# Altium schematic sheet 05-StepperMotor.SchDoc
size A
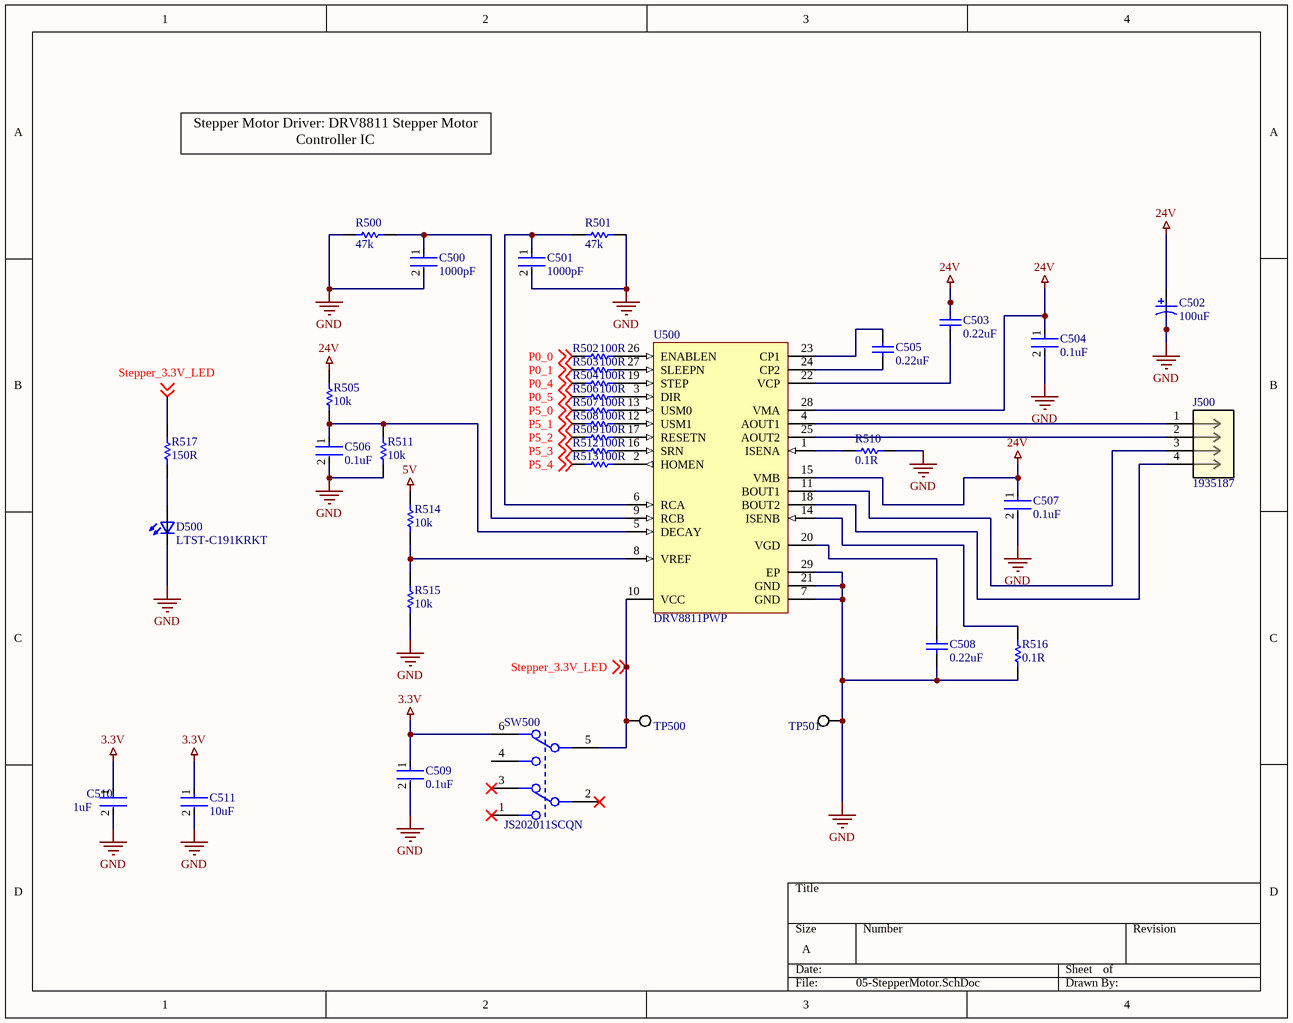
[diagram p0: 05-StepperMotor.SchDoc]

## Parts
C500  1000pF  [FP-0805-L_2_01_0_2-W_1_25-IPC_C]
C501  1000pF  [FP-0805-L_2_01_0_2-W_1_25-IPC_C]
C502  100uF  [PNSC-EEEFK1C101P_L]
C503  0.22uF  [CAPC2013X94X50ML20T25]
C504  0.1uF  [FP-CL21-IPC_C]
C505  0.22uF  [CAPC2013X94X50ML20T25]
C506  0.1uF  [FP-CL21-IPC_C]
C507  0.1uF  [FP-CL21-IPC_C]
C508  0.22uF  [CAPC2013X94X50ML20T25]
C509  0.1uF  [FP-CL21-IPC_C]
C510  1uF  [FP-CC0805-0_85-MFG]
C511  value 10uF  [FP-C0805C-DG-MFG]  (hidden comment: C0805C106K8PACTU)
D500  LTST-C191KRKT  [0603]
J500  1935187  [1935187]
R500  47k  [RESC2013X70X40ML20T20]
R501  47k  [RESC2013X70X40ML20T20]
R502  100R  [RESC2013X60X40ML20T25]
R503  100R  [RESC2013X60X40ML20T25]
R504  100R  [RESC2013X60X40ML20T25]
R505  10k  [RESC2013X60X35ML10T20]
R506  100R  [RESC2013X60X40ML20T25]
R507  100R  [RESC2013X60X40ML20T25]
R508  100R  [RESC2013X60X40ML20T25]
R509  100R  [RESC2013X60X40ML20T25]
R510  0.1R  [RESC2013X50X40ML20T20]
R511  10k  [RESC2013X60X35ML10T20]
R512  100R  [RESC2013X60X40ML20T25]
R513  100R  [RESC2013X60X40ML20T25]
R514  10k  [RESC2013X60X35ML10T20]
R515  10k  [RESC2013X60X35ML10T20]
R516  0.1R  [RESC2013X50X40ML20T20]
R517  150R  [RESC3216X70X50ML20T25]
SW500  JS202011SCQN  [FP-JS202011SCQN-MFG]
TP500  5019  [KSTN-5019_V]  (value not drawn)
TP501  5019  [KSTN-5019_V]  (value not drawn)
U500  DRV8811PWP  [StepperMotor]

## Nets
3.3V: C509.1 C510.1 C511.1 SW500.6
5V: R514.2
24V: C502.1 C503.2 C504.1 C507.1 R505.2 U500.15(VMB) U500.28(VMA)
GND: C500.2 C501.2 C502.2 C504.2 C506.2 C507.2 C508.1 C509.2 C510.2 C511.2 D500.1(K2) R500.1 R501.2 R510.2 R511.1 R515.1 R516.1 TP501.1 U500.7(GND) U500.21(GND) U500.29(EP)
P0_0: R502.1 ; off-sheet P0_0
P0_1: R503.1 ; off-sheet P0_1
P0_4: R504.1 ; off-sheet P0_4
P0_5: R506.1 ; off-sheet P0_5
P5_0: R507.1 ; off-sheet P5_0
P5_1: R508.1 ; off-sheet P5_1
P5_2: R509.1 ; off-sheet P5_2
P5_3: R512.1 ; off-sheet P5_3
P5_4: R513.1 ; off-sheet P5_4
Stepper_3.3V_LED: R517.2 SW500.5 TP500.1 U500.10(VCC) ; off-sheet Stepper_3.3V_LED
NetC500_1: C500.1 R500.2 U500.9(RCB)
NetC501_1: C501.1 R501.1 U500.6(RCA)
NetC503_1: C503.1 U500.22(VCP)
NetC505_1: C505.1 U500.24(CP2)
NetC505_2: C505.2 U500.23(CP1)
NetC506_1: C506.1 R505.1 R511.2 U500.5(DECAY)
NetC508_2: C508.2 U500.20(VGD)
NetD500_2: D500.2(A2) R517.1
NetJ500_1: J500.1 U500.4(AOUT1)
NetJ500_2: J500.2 U500.25(AOUT2)
NetJ500_3: J500.3 U500.11(BOUT1)
NetJ500_4: J500.4 U500.18(BOUT2)
NetR502_2: R502.2 U500.26(ENABLEN)
NetR503_2: R503.2 U500.27(SLEEPN)
NetR504_2: R504.2 U500.19(STEP)
NetR506_2: R506.2 U500.3(DIR)
NetR507_2: R507.2 U500.13(USM0)
NetR508_2: R508.2 U500.12(USM1)
NetR509_2: R509.2 U500.17(RESETN)
NetR510_1: R510.1 U500.1(ISENA)
NetR512_2: R512.2 U500.16(SRN)
NetR513_2: R513.2 U500.2(HOMEN)
NetR514_1: R514.1 R515.2 U500.8(VREF)
NetR516_2: R516.2 U500.14(ISENB)

Not connected (* = marked no-connect by the designer): SW500 1* 2* 3* 4

## Notes on the sheet
- Stepper Motor Driver: DRV8811 Stepper Motor Controller IC

## Library data of the parts
C500 C501 = CMP-2007-04270-2: General Purpose Ceramic Capacitor, 0805, 1nF, 5%, C0G, 30ppm/°C, 50V; Insulation Resistance: 100GR; Capacitance: 1nF; Voltage Rating (DC): 50V; Packaging: Tape and Reel; Min Operating Temperature: -55°C; Series: -; Construction: Flat; Tolerance: 5%; RoHS Compliant: Yes; Package Quantity: 1; Case Code (Metric): 2012; Lead Free: Lead Free; Thickness: 0.037inch; REACH SVHC: No SVHC; Temperature Coefficient: 30ppm/°C; Case/Package: 0805; Case Code: 0805; Radiation Hardening: No; Size: 0.94mm; Height: 0.94mm; Width: 0.049inch; Number of Pins: 2; Depth: 1.25mm; Dielectric: C0G; Contact Plating: Tin; Length: 2.01mm; Voltage: 50V; Voltage Rating: 50V; Max Operating Temperature: 125°C; Mount: Surface Mount; Case Code (Imperial): 0805; Termination: SMD/SMT
C502 = CMP-2000-06203-1: Aluminum Electrolytic Capacitor, 100 uF, 20%, 16 V, -55 to 105 degC, 2-Pin SMD, RoHS, Tape and Reel; Manufacturer: Panasonic; Lifetime@Temperature: 2000Hrs@105°C; Impedance: 0.36O; Ripple Current: 240mA; Rated Voltage: 16V; Type: Can; Capacitance: 100µF; Datasheet URL: http://datasheet.octopart.com/EEEFK1C101P-Panasonic-datasheet-13266987.pdf; Package Description: 2-Pin Surface Mount Device, Body 6.6 x 6.6 mm; Manufacturer URL: http://www.panasonic.com/; Case Size/Dimension: Ø6.3x5.8mm; Series: FK; Datasheet Version: 11/2012; Mounting Technology: SurfaceMount; Package Reference: EEEFK1C101P; Operating Temp-Max: 105°C; Operating Temp Range: -55to+105°C
C503 C505 C508 = CMP-2007-04189-1: Part Number: 08051C224KAT2A; Manufacturer: AVX Interconnect / Elco
C504 C506 C507 C509 = CMP-2000-05017-2: CL21 Series 0805 100nF 50V ±10% Tolerance X7R Multilayer Ceramic Chip Capacitor; Depth: 1.25mm; Height: 0.85mm; Width: 0.049inch; Tolerance: 10%; Case Code (Metric): 2012; Case Code (Imperial): 0805; Material: Ceramic; Thickness: 0.037inch; Min Operating Temperature: -55°C; Contact Plating: Tin; Length: 2mm; Mount: Surface Mount; Voltage Rating (DC): 50V; Lead Free: Lead Free; Dielectric: X7R; Radiation Hardening: No; Capacitance: 100nF; Voltage Rating: 50V; Case/Package: 0805; Packaging: Tape and Reel; Max Operating Temperature: 125°C; Voltage: 50V
C510 = CMP-03422-000182-1: CAP CER 1UF 10V X7R 0805; Manufacturer: Yageo; Manufacturer Part Number: CC0805KKX7R6BB105; Material: Ceramic; Tolerance: 0.1; Value: 1 uF; ComponentLink2URL: http://www.yageo.com/documents/recent/UPY-GPHC_Y5V_6.3V-to-50V_8.pdf; Automotive: No; Temperature Range Low: -30°C; Octopart: https://octopart.com/cc0805kkx7r6bb105-yageo-42522859; Temperature Characteristic: X7R; RoHS: TRUE; Voltage Rating: 10 V; Capacitance: 1 uF; Package: CC0805-0.85; Device Class L3: Ceramic Capacitors; Category: Cap; Mouser Description: Multilayer Ceramic Capacitors MLCC - SMD/SMT 1.0uF 10V X7R 10%; Temperature Range High: +85°C; Ipc Land Pattern Name: CAPC200125X85; ComponentLink2Description: Datasheet; Temperature: -30°C to +85°C; Height: 0.95mm; Lead Free: Yes; Device Class L1: Passive Components; Device Class L2: Capacitors; Footprint Url: http://www.yageo.com/exep/pages/download/literatures/UPY-C_GEN_24.pdf; Digikey Description: CAP CER 1UF 10V X7R 0805
C511 = CMP-2007-03243-2: CAP CER 10UF 10V X5R 0805; Manufacturer: Kemet; 3DS Part Number: 220-00001; Tolerance: 10%; Temperature Coefficient: 15%; Material: Ceramic; Device Class L2: Capacitors; Device Class L1: Passive Components; ComponentLink2URL: https://content.kemet.com/datasheets/KEM_C1006_X5R_SMD.pdf; Height: 1.4mm; Lead Free: Yes; Manufacturer Part Number: C0805C106K8PACTU; Digikey Description: CAP CER 10UF 10V X5R 0805; Octopart: https://octopart.com/c0805c106k8pactu-kemet-98697; Capacitance: 10uF; Temperature Range Low: -55°C; Temperature: -55°C to +85°C; Automotive: No; Mouser Description: CAP CER 10UF 10V X5R 0805; Ipc Land Pattern Name: CAPC200125X125; Temperature Range High: +85°C; Voltage: 10V; RoHS: TRUE; Device Class L3: Ceramic Capacitors; ComponentLink2Description: Datasheet; Voltage Rating: 10V; Package: C0805C-DG; Temperature Characteristic: X5R; Category: Cap; Supplier 1: Digi-Key; Supplier Part Number 1: 399-C0805C106K8PAC7800CT-ND; Manufacturer 1: KEMET; Manufacturer Part Number 1: C0805C106K8PACTU; Stock 1: 8631846; Pricing 1: 1=0.14000, 10=0.10300, 50=0.05840, 100=0.04830, 500=0.03388, 1000=0.02805 (USD); Mount: Surface Mount; Case/Package: 0805; Number of Pins: 2; Case Code (Imperial): 0805; Case Code (Metric): 2012; Dielectric Material: Ceramic; Contact Plating: Tin,Matte; Min Operating Temperature: -55°C; Max Operating Temperature: 85°C; Packaging: Tape and Reel; Dielectric: X5R; Package Quantity: 1; Voltage Rating (DC): 10V; Series: C; Termination: SMD/SMT; Construction: Flat; Dissipation Factor: 10%; Length: 2mm; Width: 1.2mm; Depth: 1.25mm; Thickness: 0.055inch; Radiation Hardening: No; REACH SVHC: No SVHC; RoHS Compliant: Yes
D500 = LTST-C191KRKT: http://octopart.com/ltst-c190krkt-lite-on-549893; Package: None; MP: LTST-C191KRKT; Value: *; Availability: Unavailable; Price: None; Supplier 1: Digi-Key; Supplier Part Number 1: 160-1447-1-ND
J500 = 1935187: No Description Available; Mfr_Name: Phoenix Contact; RefDes: RefDes; Type: Type; Supplier 1: Digi-Key; Supplier Part Number 1: 277-1579-ND
R500 R501 = CMP-2001-00421-1: Manufacturer: Panasonic; Part Number: ERJ-6GEYJ473V
R502-R504 R506-R509 R512 R513 = CMP-2001-00580-1: Manufacturer: Panasonic; Part Number: ERA6AEB101V
R505 R511 R514 R515 = CMP-2000-05025-1: Chip Resistor, 10 KOhm, +/- 5%, 0.125 W, -55 to 155 degC, 0805 (2012 Metric), RoHS, Tape and Reel; Manufacturer: Yageo; Resistor Element Type: ThickFilm; Voltage Rating: 150V; Product Range: RCSeries; SVHC: ToBeAdvised; Resistor Case Style: 0805[2012Metric]; Temperature Coefficient: ±100ppm/degC; Power Rating: 250mW; Resistance: 10kohm; Automotive Qualification Standard: -; Datasheet Version: REV. 2, 09/2004; Packaging: CutTape; Resistance Tolerance: ±5%; MSL: MSL1-Unlimited; Manufacturer URL: http://www.yageo.com/; Datasheet URL: http://www.yageo.ru/pdf/RC0805.pdf; Package Description: 2-Pin Surface Mounted Device, Body 2 x 1.25 mm; Package Reference: 805
R510 R516 = CMP-2001-03150-1: Manufacturer: Susumu; Part Number: RL1220S-R10-F
R517 = CMP-2003-04422-1: Manufacturer: Panasonic; Part Number: ERA8AEB151V
SW500 = CMP-2000-05087-3: SWITCH SLIDE DPDT 300MA 6V; Switch Function: On-On; Actuator Type: Standard; Switch Travel: 2mm; Actuator Color: Black; Contact Resistance: 70mR; Electrical Life: 5000Cycles; Actuator Material: Nylon; REACH SVHC: No SVHC; Series: JS; Min Operating Temperature: -20°C; Depth: 7.5mm; Housing Material: Nylon; Voltage Rating (DC): 6V; Max Operating Temperature: 85°C; Contact Current Rating: 300mA; Package Quantity: 1; Contact Plating: Silver; Contact Material: Copper Alloy; Throw Configuration: DPDT; Current Rating: 300mA; Orientation: Vertical; Max Current Rating: 300mA; Max Voltage Rating (DC): 6V; Flammability Rating: UL94 V-2; Length: 9mm; Packaging: Tape and Reel; Mount: Surface Mount; Actuator Length: 2mm; Lead Free: Lead Free; Termination: Gull Wing; Radiation Hardening: No
TP500 TP501 = CMP-1672-00008-1: Test Point, 1 Position SMD, RoHS, Tape and Reel; Manufacturer 1: Keystone Electronics; ComponentLink1Description: Manufacturer URL; Package Quantity: 1000; DatasheetVersion: 03/2014; Packaging: Tape and Reel; ComponentLink2URL: http://www.keyelco.com/product-pdf.cfm?p=1357; ComponentLink1URL: http://www.keyelco.com/; Mount: Surface Mount; Contact Plating: Silver; PackageDescription: 1-Pin Surface Mount Device, Body 3.81 x 2.03 mm; Pins: 1; RoHSCompliant: True; Mounting Technology: Surface Mount; ComponentLink2Description: Datasheet; PackageReference: 5019; Supplier 1: Digi-Key; Supplier Part Number 1: 36-5019CT-ND; Manufacturer Part Number 1: 5019; RoHS: Yes; Category: Connectors; Stock 1: 1316816; Pricing 1: 1=0.34000, 25=0.27360, 100=0.22340, 250=0.20064, 500=0.19152 (USD); Number of Pins: 1; Material: Bronze; Contact Material: Bronze; Series: 5019; Termination: SMD/SMT; Height: 0.09inch; RoHS Compliant: Yes; REACH SVHC: No SVHC; Lead Free: Lead Free; ComponentLink3URL: https://datasheet.ciiva.com/16318/m60-2p61-16318395.pdf?src-supplier=Future+Electronics; ComponentLink3Description: https://datasheet.ciiva.com/16318/m60-2p61-16318395.pdf?src-supplier=Future+Electronics; ComponentLink4URL: https://datasheet.ciiva.com/16885/70182998-16885945.pdf?src-supplier=Allied+Electronics; ComponentLink4Description: https://datasheet.ciiva.com/16885/70182998-16885945.pdf?src-supplier=Allied+Electronics; ComponentLink5URL: https://datasheet.ciiva.com/14848/m60-2p61-14848437.pdf?src-supplier=Digi-Key; ComponentLink5Description: https://datasheet.ciiva.com/14848/m60-2p61-14848437.pdf?src-supplier=Digi-Key; ComponentLink6URL: https://datasheet.ciiva.com/14848/m60-2p61-14848438.pdf?src-supplier=Digi-Key; ComponentLink6Description: https://datasheet.ciiva.com/14848/m60-2p61-14848438.pdf?src-supplier=Digi-Key; ComponentLink7URL: https://datasheet.ciiva.com/14848/m60-2p61-14848439.pdf?src-supplier=Digi-Key; ComponentLink7Description: https://datasheet.ciiva.com/14848/m60-2p61-14848439.pdf?src-supplier=Digi-Key
U500 = StepperMotor: 1.9 A Bipolar Stepper Motor Driver with On-Chip 1 / 8 Microstepping Indexer (Step / Dir Ctrl), -40 to 85 degC, 28-pin HTSSOP (PWP), Green (RoHS & no Sb/Br); Thermal Shutdown: TRUE; Peak Output Current(A): 1.9; PackageVersion: 4073225-6/I, 05/2011; ComponentLink2URL: http://www.ti.com/general/docs/lit/getliterature.tsp?genericPartNumber=DRV8811&fileType=pdf; Eco-Plan: Green (RoHS & no Sb/Br); ComponentLink3URL: http://www.ti.com/litv/pdf/mpds373; PackageDescription: 28-Pin Plastic Small Outline, Body 9.70 x 4.40 mm, Pitch 0.65 mm; DatasheetVersion: SLVS865G; Code_JEDEC: MO-153; ComponentLink1URL: http://www.ti.com/; ComponentLink1Description: Manufacturer URL; ComponentLink2Description: Datasheet; Package Reference: PWP0028C; PartNumber: DRV8811PWP; Mounting Technology: Surface Mount; ComponentLink3Description: Package Specification